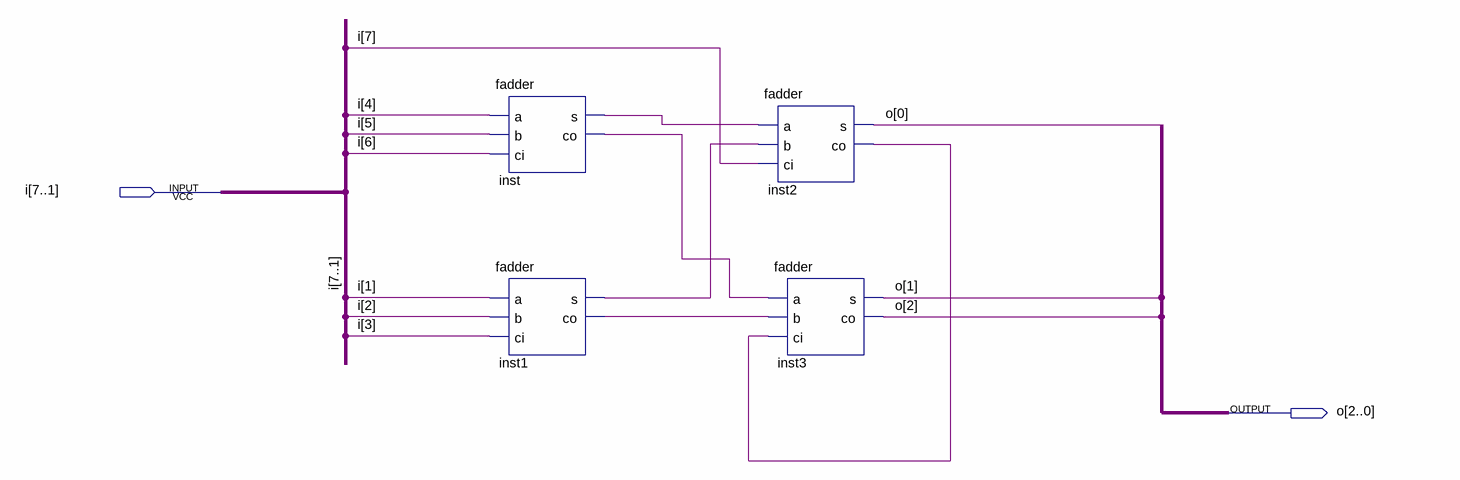
[diagram p0: schematic sheet]
// Quartus schematic wallacec.bdf as structural Verilog: 4 symbols, 2 pins
module wallacec (
  input  [7:1] i,
  output [2:0] o
);

  wire inst1_co, inst1_s, inst2_co, inst_co, inst_s;

  fadder inst (.a(i[4]), .b(i[5]), .ci(i[6]), .s(inst_s), .co(inst_co));
  fadder inst1 (.a(i[1]), .b(i[2]), .ci(i[3]), .s(inst1_s), .co(inst1_co));
  fadder inst2 (.a(inst_s), .b(inst1_s), .ci(i[7]), .s(o[0]), .co(inst2_co));
  fadder inst3 (.a(inst_co), .b(inst1_co), .ci(inst2_co), .s(o[1]), .co(o[2]));
endmodule
